# EAGLE design ATtiny85 Board (EAGLE 8.5.2)
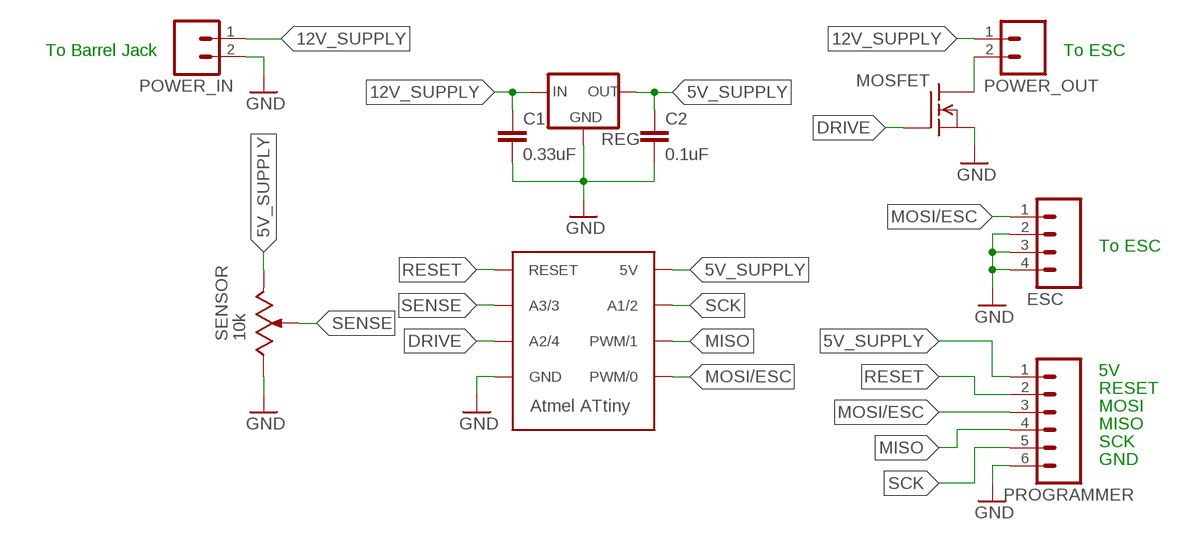
[diagram p0: schematic, sheet 1]

## Parts
C1  0.33uF  CAP0805  [0805]
C2  0.1uF  CAP0805  [0805]
ESC  M04  [1X04]
MOSFET  SI2312  [SOT-23]
POWER_IN  M02  [1X02]
POWER_OUT  M02  [1X02]
PROGRAMMER  M06  [1X06]
REG  L78L  [SOT-89]
SENSOR  10k  SV03  [SV03A]
U$1  ATTINY  [8S2]

## Nets
5V_SUPPLY: C2.1 PROGRAMMER.1 REG.1(OUT) SENSOR.1(E) U$1.8(5V)
12V_SUPPLY: C1.1 POWER_IN.1 POWER_OUT.1 REG.3(IN)
DRIVE: MOSFET.1(G) U$1.3(A2/4)
GND: C1.2 C2.2 ESC.2 ESC.3 ESC.4 MOSFET.2(S) POWER_IN.2 PROGRAMMER.6 REG.2(GND) REG.2.1(GND) REG.2.2(GND) SENSOR.3(A) U$1.4(GND)
MISO: PROGRAMMER.4 U$1.6(PWM/1)
MOSI/ESC: ESC.1 PROGRAMMER.3 U$1.5(PWM/0)
N$3: MOSFET.3(D) POWER_OUT.2
RESET: PROGRAMMER.2 U$1.1(RESET)
SCK: PROGRAMMER.5 U$1.7(A1/2)
SENSE: SENSOR.2(S) SENSOR.2.1(S) U$1.2(A3/3)

## Notes on the sheet
- To Barrel Jack | To ESC
- To ESC
- 5V
- RESET
- MOSI
- MISO
- SCK
- GND

## Library data of the parts
C1 C2 = Controls Library:CAP: Capacitor Standard 0603 ceramic capacitor, and 0.1" leaded capacitor.
ESC = Controls Library:M04: Standard 4-pin 0.1" header. NOTES ON THE VARIANTS LOCK and LOCK_LONGPADS... This footprint was designed to help hold the alignment of a through-hole component (i.e. 6-pin header) while soldering it into place. You may notice that each hole has been shifted either up or down by 0.005 of an inch from it's more standard position (which is a perfectly straight line). This slight alteration caused the pins (the squares in the middle) to touch the edges of the holes. Because they are alternating, it causes a "brace" to hold the component in place. 0.005 has proven to be the perfect amount of "off-center" position when using our standard breakaway headers. Although looks a little odd when you look at the bare footprint, once you have a header in there, the alteration is very hard to notice. Also,if you push a header all the way into place, it is covered up entirely on the bottom side. This idea of altering the position of holes to aid alignment will be further integrated into the Sparkfun Library for other footprints. It can help hold any component with 3 or more connection pins. Note: The Sparkfun version includes many other packages including surface mount that may be of future interest. Source: Sparkfun <https://github.com/sparkfun/SparkFun-Eagle-Libraries>
MOSFET = Controls Library:SI2312: Micro Commerical Components N-Channel MOSFET Vds: 20 V (MAX) Id: 5A (MAX) Vgs: 8 V (MAX) Rds(on): 0.0318 Ohms (Vgs=4.5V, ID=5.0A) Datasheet <http://www.mccsemi.com/up_pdf/SI2312(SOT-23).pdf>
POWER_IN POWER_OUT = Controls Library:M02: Standard 2-pin 0.1" header. NOTES ON THE VARIANTS LOCK and LOCK_LONGPADS... This footprint was designed to help hold the alignment of a through-hole component (i.e. 6-pin header) while soldering it into place. You may notice that each hole has been shifted either up or down by 0.005 of an inch from it's more standard position (which is a perfectly straight line). This slight alteration caused the pins (the squares in the middle) to touch the edges of the holes. Because they are alternating, it causes a "brace" to hold the component in place. 0.005 has proven to be the perfect amount of "off-center" position when using our standard breakaway headers. Although looks a little odd when you look at the bare footprint, once you have a header in there, the alteration is very hard to notice. Also,if you push a header all the way into place, it is covered up entirely on the bottom side. This idea of altering the position of holes to aid alignment will be further integrated into the Sparkfun Library for other footprints. It can help hold any component with 3 or more connection pins. Note: The Sparkfun version includes many other packages including surface mount that may be of future interest. Source: Sparkfun <https://github.com/sparkfun/SparkFun-Eagle-Libraries>
PROGRAMMER = Controls Library:M06: Standard 6-pin 0.1" header. NOTES ON THE VARIANTS LOCK and LOCK_LONGPADS... This footprint was designed to help hold the alignment of a through-hole component (i.e. 6-pin header) while soldering it into place. You may notice that each hole has been shifted either up or down by 0.005 of an inch from it's more standard position (which is a perfectly straight line). This slight alteration caused the pins (the squares in the middle) to touch the edges of the holes. Because they are alternating, it causes a "brace" to hold the component in place. 0.005 has proven to be the perfect amount of "off-center" position when using our standard breakaway headers. Although looks a little odd when you look at the bare footprint, once you have a header in there, the alteration is very hard to notice. Also,if you push a header all the way into place, it is covered up entirely on the bottom side. This idea of altering the position of holes to aid alignment will be further integrated into the Sparkfun Library for other footprints. It can help hold any component with 3 or more connection pins. Note: The Sparkfun version includes many other packages including surface mount that may be of future interest. Source: Sparkfun <https://github.com/sparkfun/SparkFun-Eagle-Libraries>
REG = Controls Library:L78L: STMicroelectronics Positive Voltage Regulator Vout: 3.3; 5; 6; 8; 9; 10; 12; 15; 18; 24V Iout: 100mA (MAX) Datasheet <http://www.st.com/content/ccc/resource/technical/document/datasheet/15/55/e5/aa/23/5b/43/fd/CD00000446.pdf/files/CD00000446.pdf/jcr:content/translations/en.CD00000446.pdf>
SENSOR = Controls Library:SV03: Murata SV03 Series Rotary Position Sensor Total Resistance: 10 kOhms +/-30% Linearity: +/-2% Effective Rotational Angle: 333.3° Rated Voltage: 5V Datasheet <https://www.murata.com/~/media/webrenewal/support/library/catalog/products/sensor/rotaryposition/r51e.ashx>
U$1 = Controls Library:ATTINY: Atmel 8-bit AVR Microcontroller 2/4/8KB Programmable Flash 0-20 MHz @ 4.5-5.5V 10-bit ADC Datasheet <http://ww1.microchip.com/downloads/en/DeviceDoc/Atmel-2586-AVR-8-bit-Microcontroller-ATtiny25-ATtiny45-ATtiny85_Datasheet.pdf>

## Board
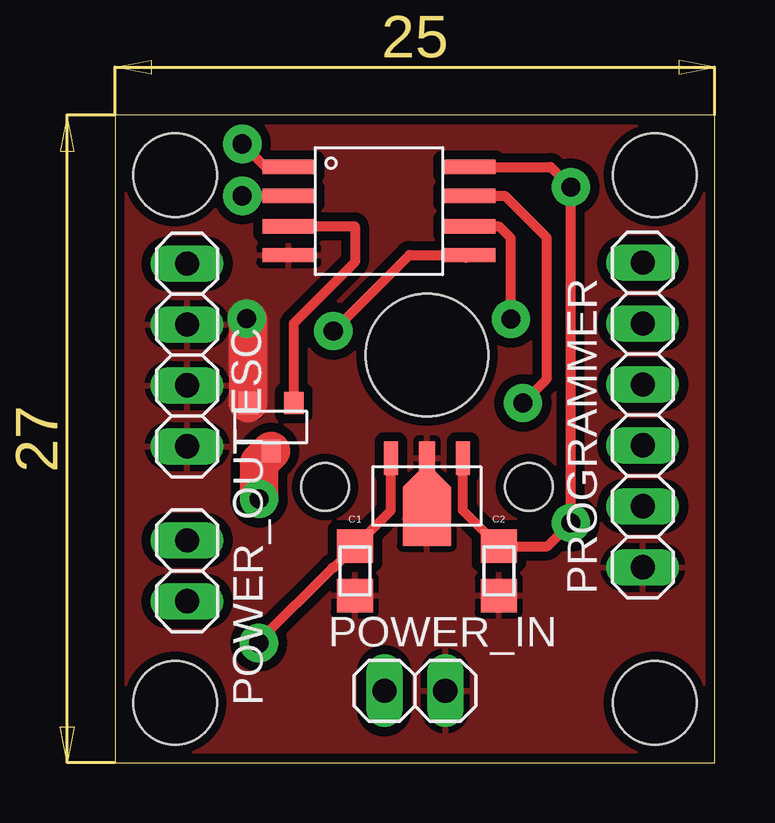
[diagram p1: board, top side]
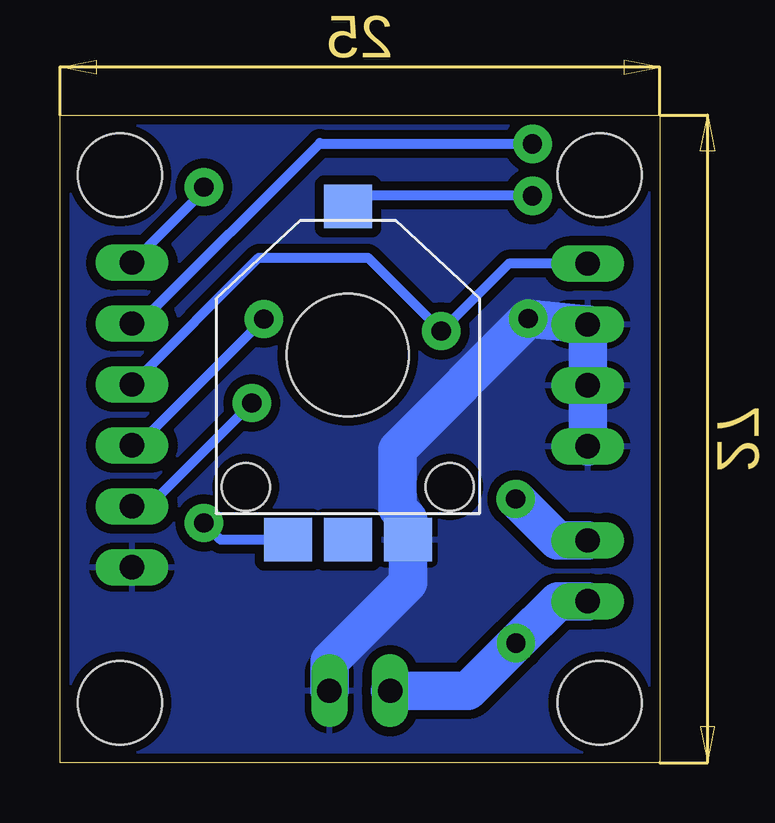
[diagram p2: board, bottom side, seen from below]

Size 25 x 27 mm. Coordinates in mm from the lower left corner, seen from the top.
Outline: 0,0 25,0 25,27 0,27 0,0
Copper layers (1*16): Top 0.035mm / dielectric 1.5mm / Bottom 0.035mm
Design rules "default *": minimum track width 6mil, minimum drill 0.35mm, track to track 15mil, track to pad 10mil, pad to pad 15mil, via to via 15mil, smd to smd 15mil, copper to edge 15mil, drill to drill 6mil, minimum pad ring 10mil, minimum via ring 8mil, stop-mask expansion 4mil, vias tented up to drill 0mil, thermal gap 10mil
Holes 3.5 mm at 2.5,2.5 22.5,2.5 2.5,24.5 22.5,24.5

### Footprints (pad centres in the part's own frame; a part is rotated, then mirrored left to right if it is on the bottom)
0805 = smd 1.4 x 1.5: 1 -1.025,0; 2 1.025,0
1X04 = drill 1.016 long: 1 -3.81,0; 2 -1.27,0; 3 1.27,0; 4 3.81,0
SOT-23 = smd 0.8 x 0.9: 1 -0.95,-1; 2 0.95,-1; 3 0,1
1X02 = drill 1.016 long: 1 -1.27,0; 2 1.27,0
1X06 = drill 1.016 long: 1 -6.35,0; 2 -3.81,0; 3 -1.27,0; 4 1.27,0; 5 3.81,0; 6 6.35,0
SOT-89 = smd 0.57 x 1.4: 1 -1.5,0; 3 1.5,0 | smd 0.65 x 1.4: 2 0,0 | smd 1.414 x 1.414 rotated 45: 2.1 0,1.2 | smd 2 x 2.45: 2.2 0,2.425
SV03A = smd 2 x 1.8: 1 -2.5,-7.7; 2 0,-7.7; 2.1 0,6.2; 3 2.5,-7.7 | hole 5.1: 0,0 | hole 2: -4.25,-5.5; 4.25,-5.5
8S2 = smd 0.6 x 2.2: 1 -1.835,-3.75; 2 -0.635,-3.75; 3 0.635,-3.75; 4 1.835,-3.76; 5 1.835,3.75; 6 0.635,3.75; 7 -0.635,3.75; 8 -1.835,3.75

### Placement (x,y rotation side)
C1  10,8 270 top
C2  16,8 270 top
ESC  3,17 270 top
MOSFET  6.5,14 180 top
POWER_IN  12.5,3 0 top
POWER_OUT  3,8 90 top
PROGRAMMER  22,14.5 270 top
REG  13,12.7 180 top
SENSOR  13,17 0 bottom
U$1  11,23 270 top

### Tracks (layer width: path | path; a pad name or v marks a point on that pad's centre or on a via)
5V_SUPPLY  (via drill 0.8 pad 1.6)
  Top 0.406: U$1.8 18.16,24.84 v19,24 v19,10 18.02,9.03 C2.1 14.5,10.53 REG.1
  Bottom 0.406: PROGRAMMER.1 19,23.85 v19,24 | v19,10 18.3,9.3 SENSOR.1
12V_SUPPLY  (via drill 0.8 pad 1.6)
  Top 0.406: REG.3 11.5,10.53 C1.1 9.11,8.13 9.06,8.13 5.99,5.06 v5.99,4.99
  Bottom 1.6: POWER_IN.1 7.98,3 v5.99,4.99 4.25,6.73 POWER_OUT.1
DRIVE
  Top 0.406: MOSFET.1 7.45,18.33 10,20.88 10,22.36 U$1.3
GND  (via drill 0.8 pad 1.6)
  Top 1.6: MOSFET.2 5.55,18.45 v5.48,18.52
  Bottom 1.6: POWER_IN.2 13.77,4.23 10.5,7.5 SENSOR.3 10.5,10.17 10.93,10.6 10.93,13.07 v5.48,18.52 ESC.2 ESC.3 ESC.4
  pour Top: -1,28 26,28 26,-1 -1,-1
  pour Bottom: -2,29 -2,-2 27,-2 27,29
MISO  (via drill 0.8 pad 1.6)
  Top 0.406: U$1.6 16,22.36 16.5,21.86 v16.5,18.5
  Bottom 0.406: v16.5,18.5 21.77,13.23 PROGRAMMER.4
MOSI/ESC  (via drill 0.8 pad 1.6)
  Top 0.406: U$1.5 14.84,21.16 | 14.64,21.06 U$1.5 | v9.1,18 12.27,21.16 U$1.5
  Bottom 0.406: PROGRAMMER.3 16.71,21.06 12.16,21.06 v9.1,18 6.29,20.81 ESC.1
N$3  (via drill 0.8 pad 1.6)
  Top 1.6: MOSFET.3 6,12.5 v6,11
  Bottom 1.6: POWER_OUT.2 4.27,9.27 v6,11
RESET  (via drill 0.8 pad 1.6)
  Top 0.406: v5.3,25.8 6.26,24.84 U$1.1
  Bottom 0.406: 21.69,18.31 14.16,25.84 14.13,25.8 v5.3,25.8
  Bottom 0.61: PROGRAMMER.2 21.69,18.31
SCK  (via drill 0.8 pad 1.6)
  Top 0.406: U$1.7 16.25,23.64 18,21.89 18,16 v17,15
  Bottom 0.406: v17,15 21.31,10.69 PROGRAMMER.5
SENSE  (via drill 0.8 pad 1.6)
  Top 0.406: v5.3,23.64 U$1.2
  Bottom 0.406: 12.9,23.1 SENSOR.2.1 12.6,23.6 | 12.9,23.1 12.8,23 | v5.3,23.64 12.37,23.64 12.9,23.1